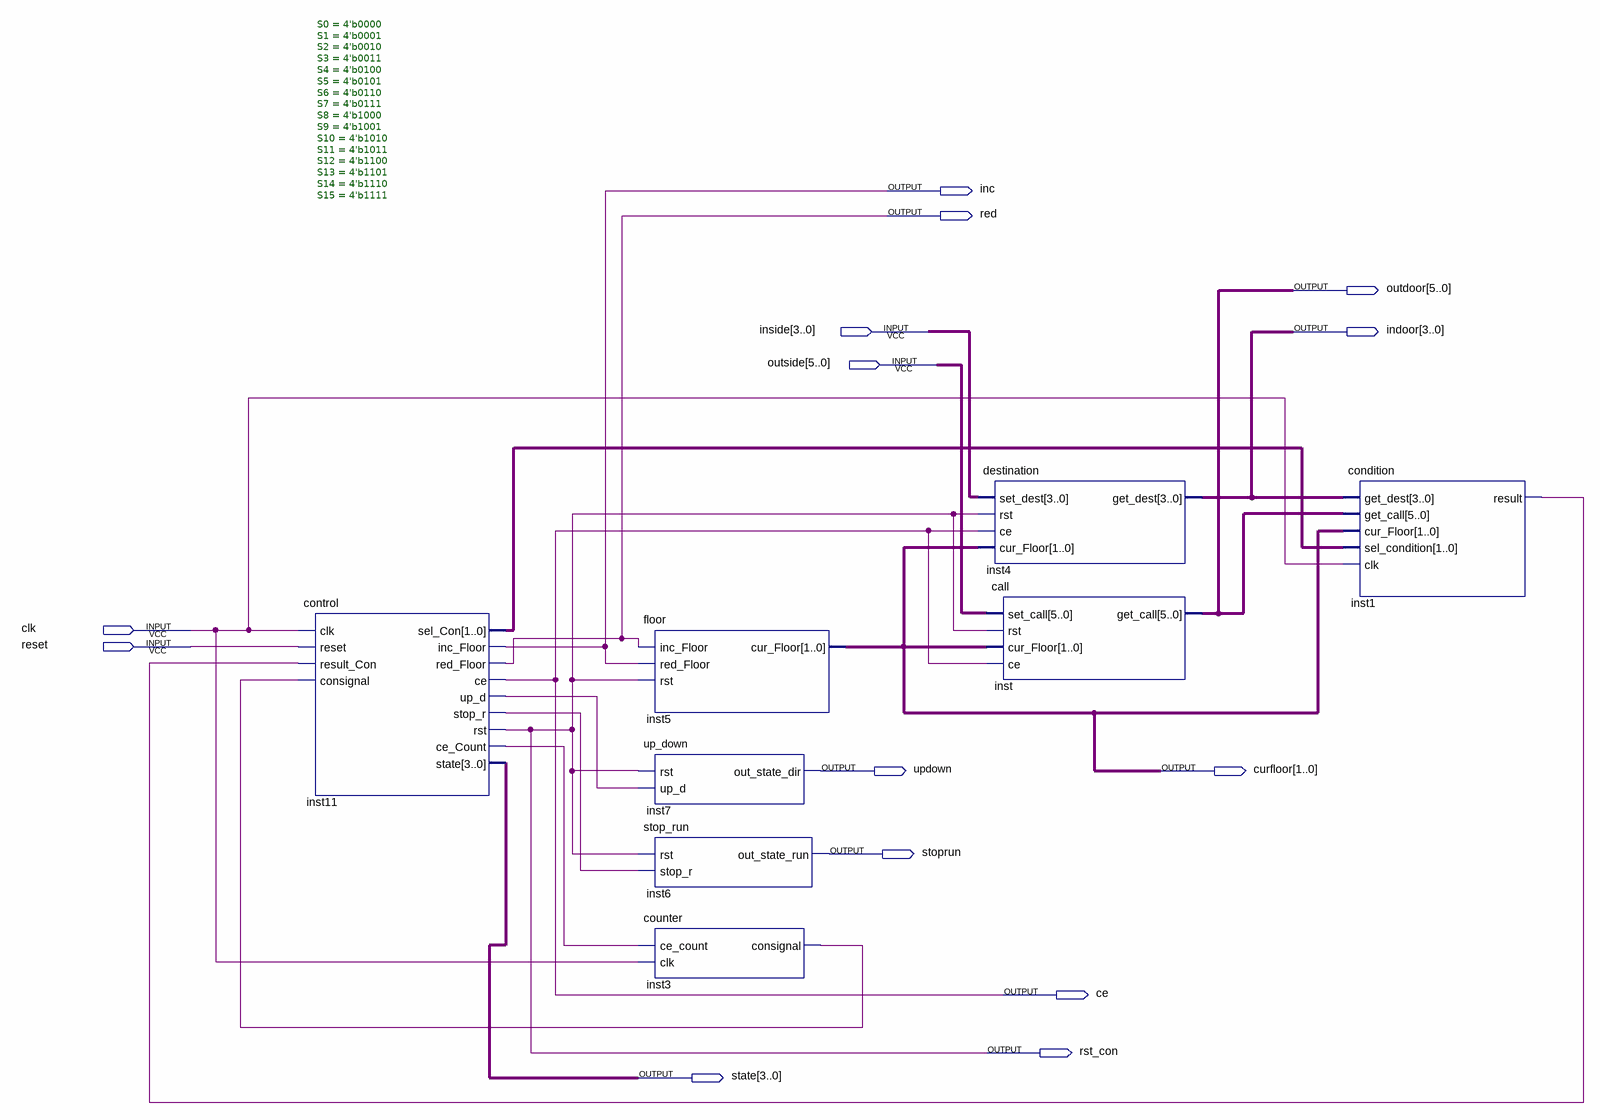
[diagram p0: schematic sheet]
// Quartus schematic top.bdf as structural Verilog: 8 symbols, 14 pins
module top (
  input  [3:0] \inside ,
  input  [5:0] outside,
  input  clk,
  input  reset,
  output inc,
  output red,
  output [5:0] outdoor,
  output [3:0] indoor,
  output updown,
  output [1:0] curfloor,
  output stoprun,
  output ce,
  output rst_con,
  output [3:0] state
);

  wire inst1_result, inst3_consignal, inst11_ce_count, inst11_stop_r, inst11_up_d;
  wire [1:0] inst11_sel_con;

  control #(.S0(4'b0000), .S1(4'b0001), .S2(4'b0010), .S3(4'b0011), .S4(4'b0100), .S5(4'b0101), .S6(4'b0110), .S7(4'b0111), .S8(4'b1000), .S9(4'b1001), .S10(4'b1010), .S11(4'b1011), .S12(4'b1100), .S13(4'b1101), .S14(4'b1110), .S15(4'b1111)) inst11 (
    .clk(clk), .reset(reset), .result_Con(inst1_result), .consignal(inst3_consignal),
    .sel_Con(inst11_sel_con), .inc_Floor(inc), .red_Floor(red), .ce(ce), .up_d(inst11_up_d),
    .stop_r(inst11_stop_r), .rst(rst_con), .ce_Count(inst11_ce_count), .state(state));
  floor inst5 (.inc_Floor(red), .red_Floor(inc), .rst(rst_con), .cur_Floor(curfloor));
  up_down inst7 (.rst(rst_con), .up_d(inst11_up_d), .out_state_dir(updown));
  stop_run inst6 (.rst(rst_con), .stop_r(inst11_stop_r), .out_state_run(stoprun));
  counter inst3 (.ce_count(inst11_ce_count), .clk(clk), .consignal(inst3_consignal));
  destination inst4 (.set_dest(\inside ), .rst(rst_con), .ce(ce), .cur_Floor(curfloor), .get_dest(indoor));
  call inst (.set_call(outside), .rst(rst_con), .cur_Floor(curfloor), .ce(ce), .get_call(outdoor));
  condition inst1 (
    .get_dest(indoor), .get_call(outdoor), .cur_Floor(curfloor), .sel_condition(inst11_sel_con), .clk(clk),
    .result(inst1_result));
endmodule
